# EasyEDA Pro project Project5.eprj

# Schematic Schematic1
Create Date: 2023-12-02; Page Name: P1; Project Name: Project5; Schematic Name: Schematic1; Update Date: 2023-12-02; Company: EasyEDA.com; Drawed: EasyEDA Pro; Page Size: A4; Part Number: JLCPCB-002; Reviewed: EasyEDA Pro; Version: V0.1
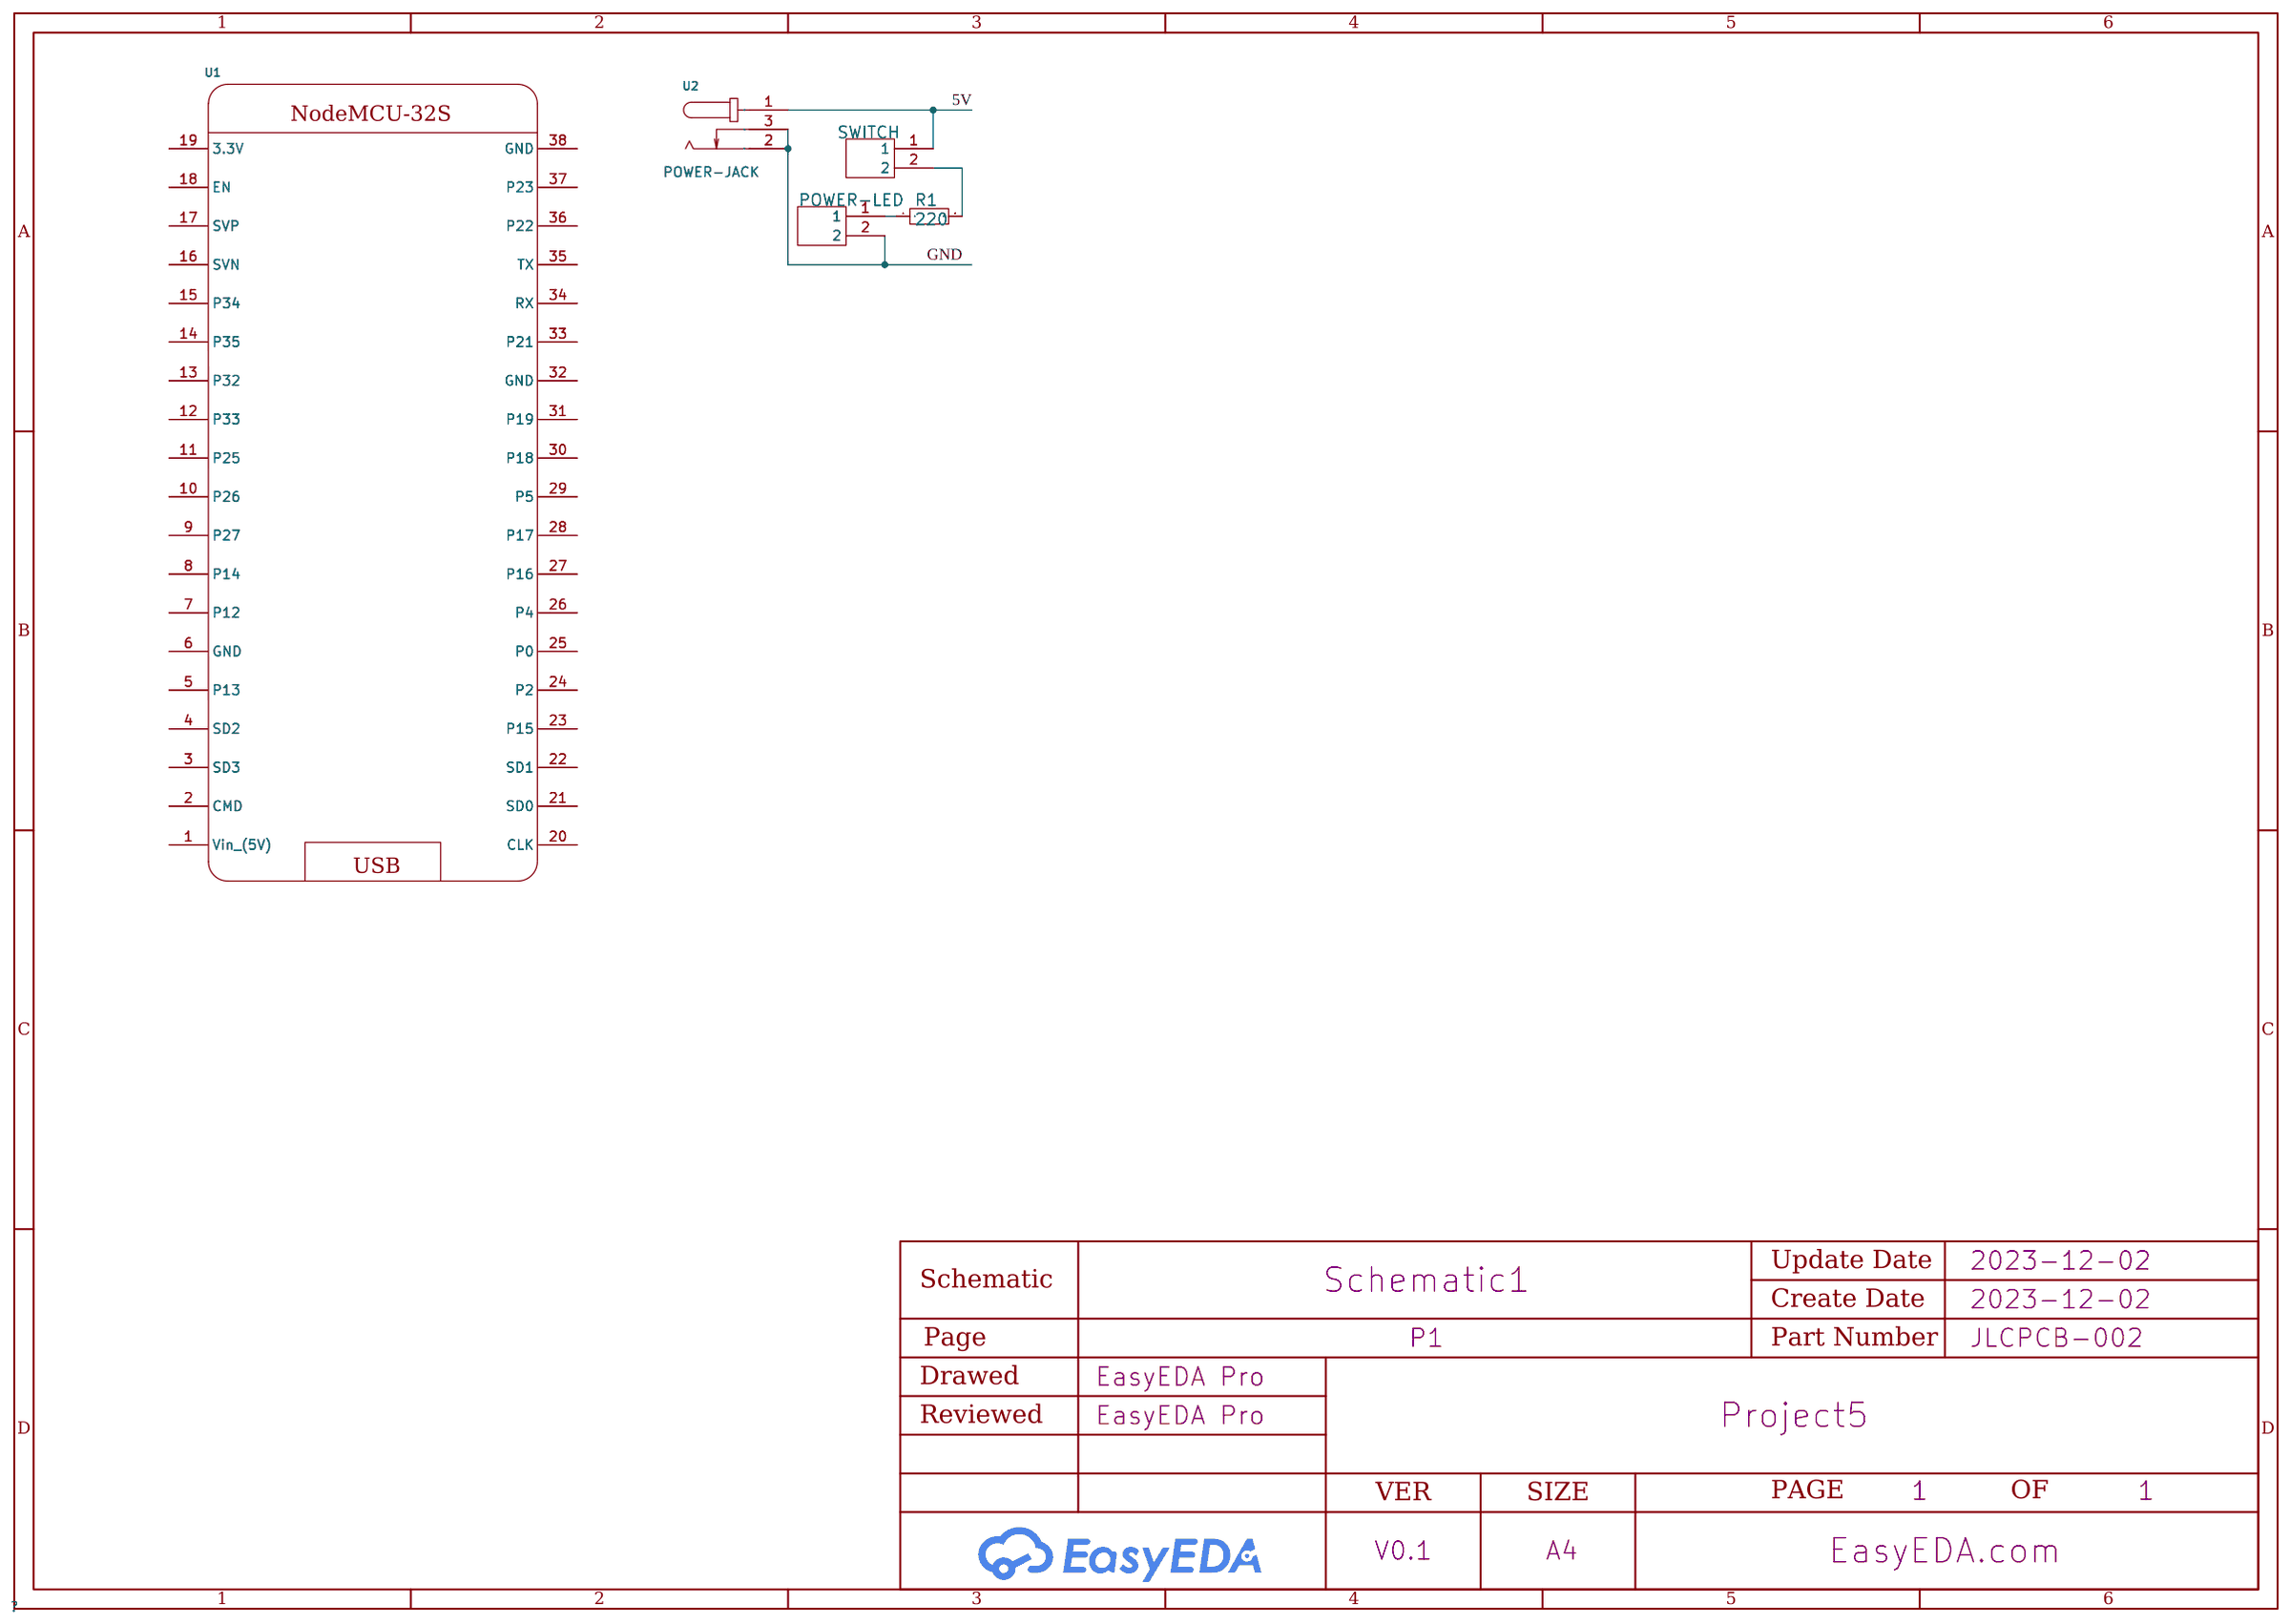
[diagram p0: schematic sheet]

## Parts
POWER-LED  -  [JST 2.54-2PIN]
R1  220  [RES35]
SWITCH  -  [JST 2.54-2PIN]
U1  -  [AI-THINKER_NODEMCU-32SLUA]
U2  POWER-JACK  [DC-IN-TH_POWER-JACK]

## Library data of the parts
POWER-LED SWITCH = device_8d2c
R1 = 220: Supplier Part: C351613; Manufacturer: ResistorToday; Manufacturer Part: PTFR0805B130KN9
U1 = AI-THINKER_NODEMCU-32SLUA
U2 = POWER-JACK: Supplier Part: C9900001795; JLCPCB Part Class: Extended Part; Supplier: LCSC

## Nets
5V: SWITCH.1 U2.1
GND: POWER-LED.2 U2.2 U2.3
Net-(POWER-LED-1): POWER-LED.1 R1.1
Net-(R1-2): R1.2 SWITCH.2

Not connected (* = marked no-connect by the designer): U1 1(Vin (5V)) 2(CMD) 3(SD3) 4(SD2) 5(P13) 6(GND) 7(P12) 8(P14) 9(P27) 10(P26) 11(P25) 12(P33) 13(P32) 14(P35) 15(P34) 16(SVN) 17(SVP) 18(EN) 19(3.3V) 20(CLK) 21(SD0) 22(SD1) 23(P15) 24(P2) 25(P0) 26(P4) 27(P16) 28(P17) 29(P5) 30(P18) 31(P19) 32(GND) 33(P21) 34(RX) 35(TX) 36(P22) 37(P23) 38(GND)
